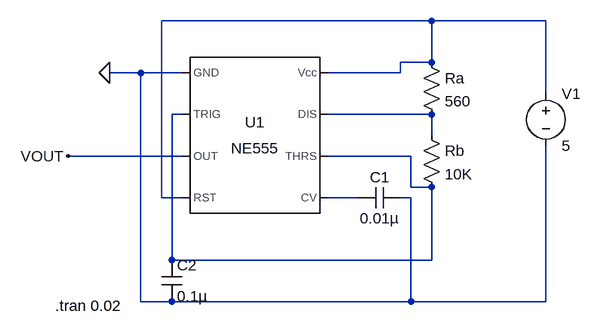
[diagram p0: schematic 555 Astable Multivibrator.asc]
555 Astable Multivibrator.asc, the LTspice schematic file:
Version 4
SHEET 1 880 680
WIRE 320 0 -96 0
WIRE 496 0 320 0
WIRE 320 64 320 0
WIRE 320 64 272 64
WIRE -128 80 -176 80
WIRE -64 80 -128 80
WIRE 272 80 272 64
WIRE 272 80 160 80
WIRE 496 112 496 0
WIRE -64 144 -80 144
WIRE 320 144 160 144
WIRE 320 176 320 144
WIRE -64 208 -240 208
WIRE 288 208 160 208
WIRE 288 256 288 208
WIRE 320 256 288 256
WIRE -96 272 -96 0
WIRE -64 272 -96 272
WIRE 208 272 160 272
WIRE 288 272 272 272
WIRE -80 368 -80 144
WIRE 320 368 320 256
WIRE 320 368 -80 368
WIRE -128 432 -128 80
WIRE -80 432 -128 432
WIRE 288 432 288 272
WIRE 288 432 -80 432
WIRE 496 432 496 192
WIRE 496 432 288 432
FLAG -176 80 0
FLAG -240 208 VOUT
SYMBOL cap 272 256 R90
WINDOW 0 0 32 VBottom 2
WINDOW 3 32 32 VTop 2
SYMATTR InstName C1
SYMATTR Value 0.01µ
SYMBOL res 304 48 R0
SYMATTR InstName Ra
SYMATTR Value 560
SYMBOL Misc\\NE555 48 176 R0
SYMATTR InstName U1
SYMBOL res 304 160 R0
SYMATTR InstName Rb
SYMATTR Value 10K
SYMBOL voltage 496 96 R0
WINDOW 123 0 0 Left 0
WINDOW 39 0 0 Left 0
SYMATTR InstName V1
SYMATTR Value 5
SYMBOL cap -96 368 R0
SYMATTR InstName C2
SYMATTR Value 0.1µ
TEXT -260 438 Left 2 !.tran 0.02

The netlist it stands for:
* 555 Astable Multivibrator.asc
C1 0 N004 0.01µ
Ra N001 N003 560
XU1 0 N002 VOUT N001 N004 N002 N003 N001 NE555  ; pins GND TRIG OUT RST CV THRS DIS Vcc
Rb N003 N002 10K
V1 N001 0 5
C2 N002 0 0.1µ
.tran 0.02
.lib NE555.sub
.backanno
.end